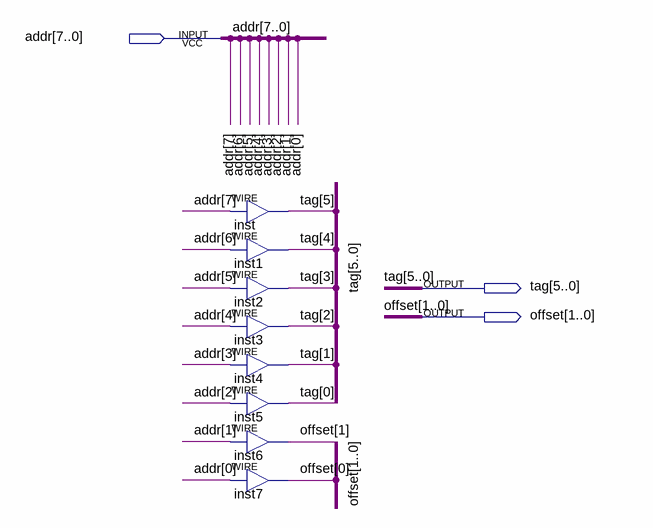
[diagram p0: schematic sheet]
// Quartus schematic addr_splitter.bdf as structural Verilog: 8 symbols, 3 pins
module addr_splitter (
  input  [7:0] addr,
  output [5:0] tag,
  output [1:0] offset
);

  assign tag[5] = addr[7];  // WIRE inst
  assign tag[4] = addr[6];  // WIRE inst1
  assign tag[3] = addr[5];  // WIRE inst2
  assign tag[2] = addr[4];  // WIRE inst3
  assign tag[1] = addr[3];  // WIRE inst4
  assign tag[0] = addr[2];  // WIRE inst5
  assign offset[1] = addr[1];  // WIRE inst6
  assign offset[0] = addr[0];  // WIRE inst7
endmodule
